# Altium project buck_boost.PrjPcb
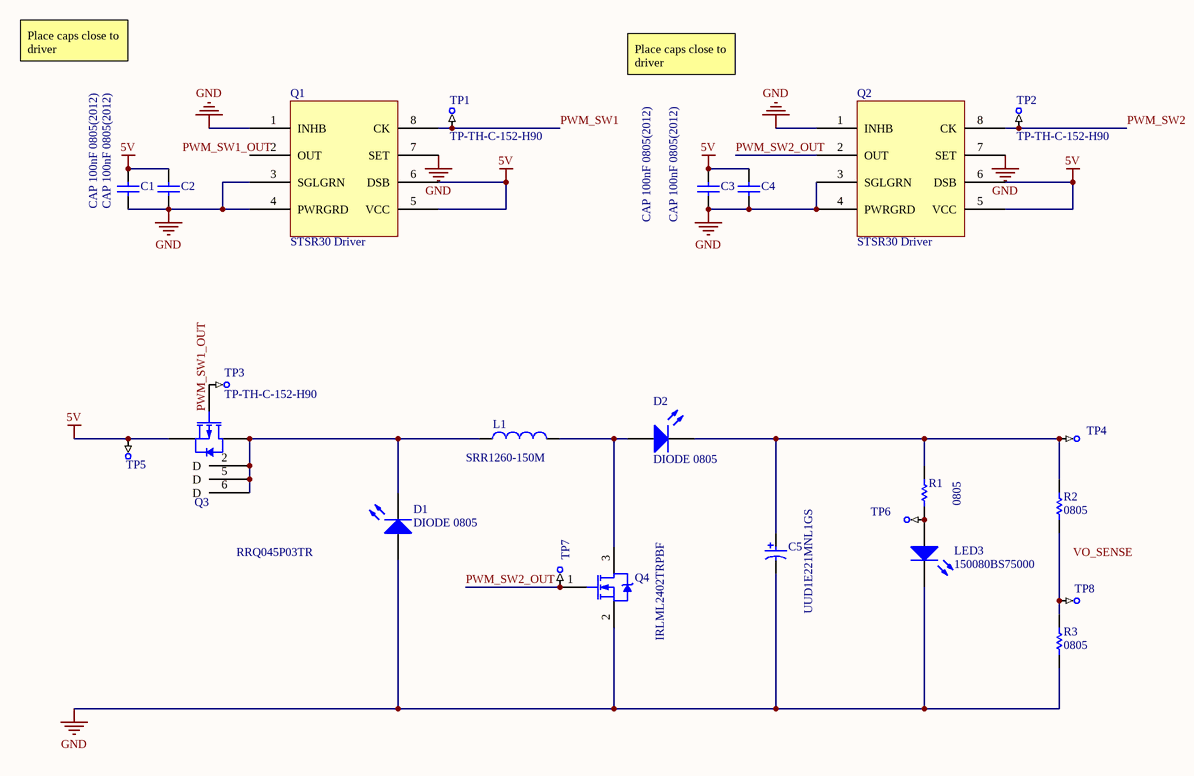
[diagram p0: buck_boost_schematic.SchDoc]
2 sheets, 49 parts. Net scope: global (net labels, ports and power ports of the same name join across sheets).
Board file: buck_boost.PcbDoc
Sheets:
  buck_boost_schematic.SchDoc
  control_and_power.SchDoc

## Sheet buck_boost_schematic.SchDoc
size A4

### Parts
C1  CAP 100nF 0805(2012)  [CAPC0805(2012)100_L]
C2  CAP 100nF 0805(2012)  [CAPC0805(2012)100_L]
C3  CAP 100nF 0805(2012)  [CAPC0805(2012)100_L]
C4  CAP 100nF 0805(2012)  [CAPC0805(2012)100_L]
C5  UUD1E221MNL1GS  [NIC-CAPA2-8X10_V]
D1  DIODE 0805  [0805_A]
D2  DIODE 0805  [0805_A]
L1  SRR1260-150M  [BOUR-SRR1260_V]
LED3  150080BS75000  [0805_A]
Q1  STSR30 Driver  [NXP-SOT96-1_L]
Q2  STSR30 Driver  [NXP-SOT96-1_L]
Q3  RRQ045P03TR  [DDC0006A_L]
Q4  IRLML2402TRPBF  [INTR-IRLML2402TRPBF-3_V]
R1  0805  [RESC0805(2012)_N]
R2  0805  [RESC0805(2012)_N]
R3  0805  [RESC0805(2012)_N]
TP1  TP-TH-C-152-H90  [TP-TH-C-152-H90]  (no BOM)
TP2  TP-TH-C-152-H90  [TP-TH-C-152-H90]  (no BOM)
TP3  TP-TH-C-152-H90  [TP-TH-C-152-H90]  (no BOM)
TP4  (no value)  [TP-TH-C-152-H90]  (no BOM)
TP5  (no value)  [TP-TH-C-152-H90]  (no BOM)
TP6  (no value)  [TP-TH-C-152-H90]  (no BOM)
TP7  (no value)  [TP-TH-C-152-H90]  (no BOM)
TP8  (no value)  [TP-TH-C-152-H90]  (no BOM)

### Nets
5V: C1.2 C2.2 C3.2 C4.2 Q1.5(VCC) Q1.6(DSB) Q2.5(VCC) Q2.6(DSB) Q3.4(S) TP5.1
GND: C1.1 C2.1 C3.1 C4.1 C5.2 D1.2(A) LED3.1(K) Q1.1(INHB) Q1.3(SGLGRN) Q1.4(PWRGRD) Q1.7(SET) Q2.1(INHB) Q2.3(SGLGRN) Q2.4(PWRGRD) Q2.7(SET) Q4.2(S) R3.1
PWM_SW1: Q1.8(CK) TP1.1
PWM_SW2: Q2.8(CK) TP2.1
PWM_SW2_OUT: Q2.2(OUT) Q4.1(G) TP7.1
NetC5_1: C5.1 D2.1(K) R1.2 R2.2 TP4.1
NetD1_1: D1.1(K) L1.1 Q3.1(D) Q3.2(D) Q3.5(D) Q3.6(D)
NetD2_2: D2.2(A) L1.2 Q4.3(D)
NetLED3_2: LED3.2(A) R1.1 TP6.1
NetQ3_3: Q3.3(G) TP3.1
NetR2_1: R2.1 R3.2 TP8.1

Not connected (* = marked no-connect by the designer): Q1 2(OUT)

### Notes on the sheet
- Place caps close to driver
- Labels drawn without touching a wire or pin: PWM_SW1_OUT, VO_SENSE

### Library data of the parts
C1-C4 = CMP-1036-04519-1: CAP 220nF 6.3V ±10% 0805 (2012 Metric) Thickness 1mm SMD; Case-EIA: 0805; Tolerance: Â±10%; Case-Metric: 2012; Max Thickness: 1 mm; Value: 220nF; Rated Voltage: 6.3 V; Technology: SMT
C5 = CMP-0687-00079-1: Aluminum Electrolytic Capacitor, UD Series, Low Impedance, 220 uF, 25 V, + / - 20%, -55 to 105 degC, Chip Type, 8 x 10 mm D x L, Pb-Free, Reel; Manufacturer: Nichicon; Impedance: 0.17 Ohm; Tolerance Rated Capacitance: -20 to 20%; Packing: Dia382mm Reel; Endurance Time: 5000 h; Rated Voltage: 25 V; Rated Ripple Current (at 100kHz): 450 mA; Rated Capacitance: 220 uF; PartNumber: UUD1E221MNL1GS; DatasheetVersion: 08/2012; ComponentLink1Description: Manufacturer URL; Length: 10 mm; ComponentLink3Description: Package Specification; RoHS: TRUE; ComponentLink2Description: Datasheet; Diameter: 8 mm; ComponentLink2URL: http://products.nichicon.co.jp/en/pdf/XJA043/e-ud.pdf; ComponentLink3URL: http://products.nichicon.co.jp/en/pdf/XJA043/e-ud.pdf; PackageReference: CAPAE-D8H10; ComponentLink1URL: http://www.nichicon.co.jp/; PackageDescription: 2-Pin Surface Mount Device, Diameter 8 mm, Height 10 mm, Pitch 6.5 mm; Mounting Technology: Surface Mount
D1 D2 = CMP-1426-00008-1: SMD mono-color Chip LED, WL-SMCW, Blue; Manufacturer: Wuerth Elektronik; PartNumber: 150080BS75000; Color: Blue; ComponentLink2URL: http://katalog.we-online.com/led/datasheet/150080BS75000.pdf; ComponentLink1URL: http://www.we-online.com; ComponentLink2Description: Datasheet; PackageReference: 0805_A; ComponentLink1Description: Manufacturer URL
L1 = CMP-2000-07146-1: Shielded Power Inductor, 15 uH, +/- 20%, -40 to 125 degC, 2-Pin SMD, RoHS, Tape and Reel; Manufacturer: Bourns; Core Material: Ferrite; Inductance: 15uH; Product Height: 6.5mm; Maximum DC Current: 5A; Maximum DC Resistance: 27mOhm; Minimum Quality Factor: 25(Typ)@2.52MHz; Package Reference: SRR1260; Package Description: 2-Pin Surface Mount Device, Body 12.5 x 12.5 mm; Datasheet URL: http://www.bourns.com/docs/Product-Datasheets/SRR1260.pdf; Mounting Technology: SurfaceMount; Category: InductorSurfaceMount; Package/Case: 12.8X12.8X6.5; Manufacturer URL: http://www.bourns.com/; Datasheet Version: 03/2015; Tolerance: 20%; Type: Power
LED3 = CMP-1426-00008-1: SMD mono-color Chip LED, WL-SMCW, Blue; Manufacturer: Wuerth Elektronik; Color: Blue; ComponentLink2URL: http://katalog.we-online.com/led/datasheet/150080BS75000.pdf; ComponentLink1URL: http://www.we-online.com; ComponentLink2Description: Datasheet; PackageReference: 0805_A; ComponentLink1Description: Manufacturer URL; PartNumber: 150080BS75000
Q1 Q2 = STSR30
Q3 = MOSFET_P - RRQ045P03TR
Q4 = CMP-2000-05155-1: HEXFET(R) Power MOSFET, N-Channel, 20 V, 1.2 A, 3-Pin SOT-23, RoHS, Tape and Reel; Manufacturer: International Rectifier; Voltage Vgs Rds on Measurement: 4.5V; Current Id Max: 1.2A; External Width: 3.05mm; Transistor Polarity: NChannel; No. of Pins: 3; Power Dissipation Pd: 540mW; External Length / Height: 1.12mm; Full Power Rating Temperature: 25degC; On Resistance Rds(on): 250mohm; Voltage Vds Typ: 20V; SMD Marking: 1A; No. of Transistors: 1; Reel Quantity: 3000; External Depth: 2.5mm; Pulse Current Idm: 7.4A; Junction Temperature Tj Min: -55degC; Threshold Voltage Vgs Typ: 700mV; SVHC: NoSVHC(19-Dec-2012); Datasheet URL: https://datasheet.ciiva.com/29326/162826-da-01-en-irlml-2402tr-29326791.pdf; Tape Width: 8mm; Operating Temperature Range: -55degCto+150degC; Manufacturer URL: http://internationalrectifier.com/; Termination Type: SMD; Datasheet Version: Jan-03; Current Temperature: 25degC; Package / Case: SOT-23; Drain Source Voltage Vds: 20V; Rds(on) Test Voltage Vgs: 4.5V; Continuous Drain Current Id: 1.2A; Transistor Case Style: SOT-23; Voltage Vgs th Min: 700mV; Voltage Vgs Max: 700mV
R1-R3 = CMP-1013-00064-1: 390R 0.125W 5% 0805 (2012 Metric)  SMD; Value: 390.00 Ohm; Case-Metric: 2012; Case-EIA: 0805; Power: 0.125 W; Tolerance: 5 %; Technology: SMT
TP1-TP8 = CMP-0484-00003-2: Test Point, Through Hole, Hole Size 0.9 mm, PCB Mount with Silkscreen Box; Manufacturer: No Vendor; PartNumber: TP-TH-C-152-H90

## Sheet control_and_power.SchDoc
size A4
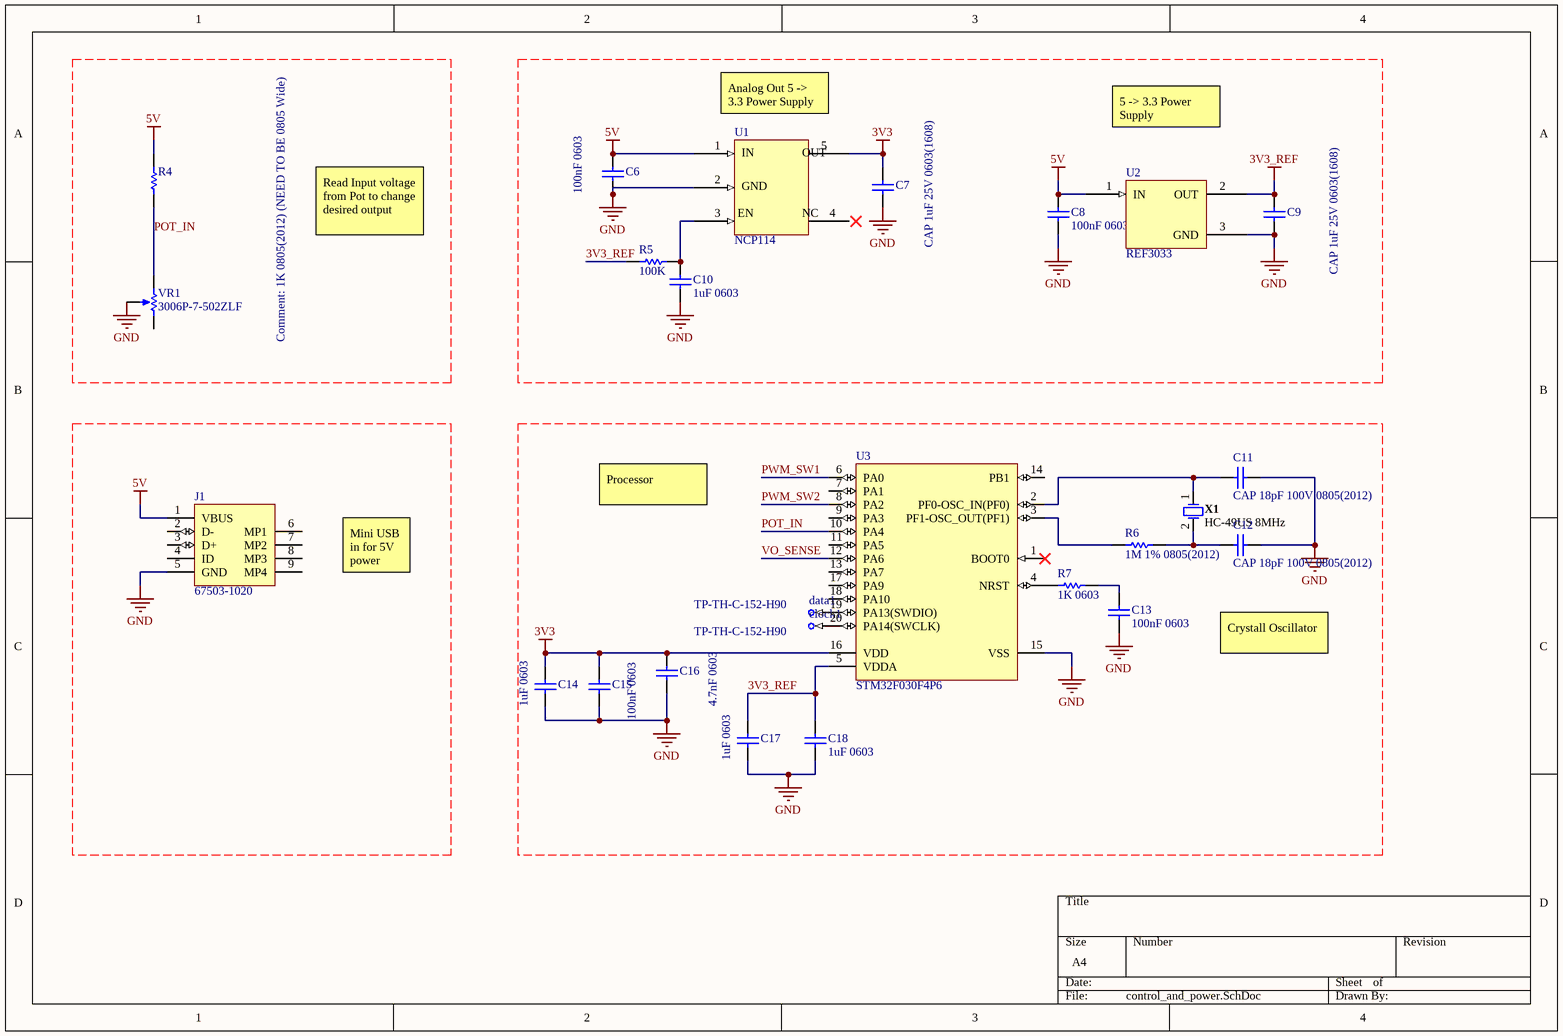
[diagram p1: control_and_power.SchDoc]

### Parts
C6  100nF 0603  [CAPC0603(1608)100_M]
C7  CAP 1uF 25V 0603(1608)  [CAPC0603(1608)100_M]
C8  100nF 0603  [CAPC0603(1608)100_M]
C9  CAP 1uF 25V 0603(1608)  [CAPC0603(1608)100_M]
C10  1uF 0603  [CAPC0603(1608)100_M]
C11  CAP 18pF 100V 0805(2012)  [CAPC0805(2012)145_M]
C12  CAP 18pF 100V 0805(2012)  [CAPC0805(2012)145_M]
C13  100nF 0603  [CAPC0603(1608)100_M]
C14  1uF 0603  [CAPC0603(1608)100_M]
C15  100nF 0603  [CAPC0603(1608)100_M]
C16  4.7nF 0603  [CAPC0603(1608)100_M]
C17  1uF 0603  [CAPC0603(1608)100_M]
C18  1uF 0603  [CAPC0603(1608)100_M]
clock1  TP-TH-C-152-H90  [TP-TH-C-152-H90]  (no BOM)
data1  TP-TH-C-152-H90  [TP-TH-C-152-H90]  (no BOM)
J1  67503-1020  [MOLX-67503-1020_V]
R4  1K 0805(2012) (NEED TO BE 0805 Wide)  [RESC0805(2012)_N]
R5  100K  [RESC0603(1608)_N]
R6  1M 1% 0805(2012)  [RESC0805(2012)_N]
R7  1K 0603  [RESC0603(1608)_N]
U1  NCP114  [SOT23-5_N]
U2  REF3033  [SOT23-3]
U3  STM32F030F4P6  [STM-TSSOP20_L]
VR1  3006P-7-502ZLF  [BOUR-3006P-3_V]
X1  HC-49US 8MHz  [JPY-HC-49US]

### Nets
3V3: C7.2 C14.2 C15.2 C16.2 U1.5(OUT) U3.16(VDD)
3V3_REF: C9.2 C17.2 C18.2 R5.1 U2.2(OUT) U3.5(VDDA)
5V: C6.2 C8.2 J1.1(VBUS) R4.2 U1.1(IN) U2.1(IN)
GND: C6.1 C7.1 C8.1 C9.1 C10.1 C11.2 C12.2 C13.1 C14.1 C15.1 C16.1 C17.1 C18.1 J1.5(GND) U1.2(GND) U2.3(GND) U3.15(VSS) VR1.2(WIPER)
POT_IN: R4.1 U3.10(PA4) VR1.3(CW)
PWM_SW1: U3.6(PA0)
PWM_SW2: U3.8(PA2)
VO_SENSE: U3.12(PA6)
NetC10_2: C10.2 R5.2 U1.3(EN)
NetC11_1: C11.1 U3.2(PF0-OSC_IN(PF0)) X1.1
NetC12_1: C12.1 R6.2 X1.2
NetC13_2: C13.2 R7.2
Netclock1_1: clock1.1 U3.20(PA14(SWCLK))
Netdata1_1: data1.1 U3.19(PA13(SWDIO))
NetR6_1: R6.1 U3.3(PF1-OSC_OUT(PF1))
NetR7_1: R7.1 U3.4(NRST)

Not connected (* = marked no-connect by the designer): J1 2(D-) 3(D+) 4(ID) 6(MP1) 7(MP2) 8(MP3) 9(MP4); U1 4(NC); U3 1(BOOT0)* 7(PA1) 9(PA3) 11(PA5) 13(PA7) 14(PB1) 17(PA9) 18(PA10); VR1 1(CCW)

### Notes on the sheet
- (near U1) Analog Out 5 -> 3.3 Power Supply
- 5 -> 3.3 Power Supply
- Read Input voltage from Pot to change desired output
- Processor
- Mini USB in for 5V power
- Crystall Oscillator

### Library data of the parts
C6-C10 C13-C18 = CMP-1035-02742-1: CAP 1uF 25V -20% to +80% 0603 (1608 Metric) Thickness 1mm SMD; Case-Metric: 1608; Case-EIA: 0603; Technology: SMT; Tolerance: -20% to +80%; Max Thickness: 1 mm; Value: 1uF; Rated Voltage: 25 V
C11 C12 = CMP-1036-01160-1: CAP 18pF 100V ±10% 0805 (2012 Metric) Thickness 1.45mm SMD; Case-Metric: 2012; Tolerance: Â±10%; Case-EIA: 0805; Value: 18pF; Max Thickness: 1.45 mm; Technology: SMT; Rated Voltage: 100 V
clock1 data1 = CMP-0484-00003-2: as TP1 on sheet buck_boost_schematic; PartNumber: TP-TH-C-152-H90
J1 = CMP-0411-00002-1: USB, MINI, SMD, RA KME04-USBMU03A01; Manufacturer: Molex; ComponentLink1URL: http://www.molex.com/; PartNumber: 67503-1020; Mounting Technology: Surface Mount; ComponentLink1Description: Manufacturer URL; Terminal Pitch: 0.8 mm; DatasheetVersion: Rev F, 06/2009; ComponentLink2Description: Datasheet; PackageDescription: Mini USB Connector, SMT, Righer Angle; ComponentLink2URL: http://www.molex.com/pdm_docs/sd/675031020_sd.pdf; PackageReference: 67503-1020
R4 = CMP-1013-00037-1: 30R 0.125W 5% 0805 (2012 Metric)  SMD; Case-Metric: 2012; Value: 30.00 Ohm; Case-EIA: 0805; Power: 0.125 W; Technology: SMT; Tolerance: 5 %
R5 R7 = CMP-1012-00542-1: 2K 0.1W 1% 0603 (1608 Metric)  SMD; Case-EIA: 0603; Case-Metric: 1608; Power: 0.1 W; Technology: SMT; Tolerance: 1 %
  R5: Value: 100K
  R7: Value: 1K
R6 = CMP-1013-00849-1: 1M 0.125W 1% 0805 (2012 Metric)  SMD; Value: 1000000.00 Ohm; Case-Metric: 2012; Case-EIA: 0805; Technology: SMT; Power: 0.125 W; Tolerance: 1 %
U3 = CMP-0304-00039-2: ARM Cortex-M0 32-bit MCU, 16 KB Flash, 4 KB Internal RAM, 15 I/Os, 20-pin TSSOP, -40 to 85 degC, Tube; I/Os (High Current): 15; FLASH Size (Prog) (kB): 16; Internal RAM Size (kB): 4; Supply Voltage(Vcc) min (V): 2.4; Operating Frequency(F) (Processor speed) (MHz): 48; ComponentLink2URL: http://www.st.com/st-web-ui/static/active/en/resource/technical/document/datasheet/DM00088500.pdf; Core: ARM Cortex-M0; ComponentLink2Description: Datasheet; PackageDescription: 20-Pin Thin Shrink Small Outline Package, 6.5 x 4.4 mm Body, 0.65 mm Pitch; Mounting Technology: Surface Mount; ComponentLink1URL: http://www.st.com/web/en/home.html; PackageVersion: Rev. 1, 11/2012; ComponentLink3Description: Package Specification; PartNumber: STM32F030F4P6; ComponentLink3URL: http://www.st.com/st-web-ui/static/active/en/resource/technical/document/datasheet/DM00065136.pdf; DatasheetVersion: Rev. 1; PackageReference: TSSOP20; ComponentLink1Description: Manufacturer URL; Packing: Tube
VR1 = CMP-0972-00009-1: Trimming Potentiometer, 5K Ohm +/- 10%, -55 to 125 degC, 3-Pin 19.05 x 4.83 x 6.6 mm THD, Transparent Housing, RoHS; Manufacturer: Bourns; Resistance (kOhm): 5; Resistance Tolerance: +/- 10%; Rotational Life: 200 Cycles; Number of Turns: 15; PackageDescription: 3-Pin THD, Body 19.05 x 4.83 mm, Height 6.6 mm; ComponentLink3Description: Package Specification; ComponentLink1URL: http://www.bourns.com/; PackageReference: 3006P-3; RoHS: TRUE; PackageVersion: Apr-14; PartNumber: 3006P-7-502ZLF; Mounting Technology: Through Hole; ComponentLink3URL: http://www.bourns.com/data/global/pdfs/3006.pdf; ComponentLink1Description: Manufacturer URL; Temperature Range: -55 to 125 degC; DatasheetVersion: Apr-14; ComponentLink2Description: Datasheet; ComponentLink2URL: http://www.bourns.com/data/global/pdfs/3006.pdf
X1 = CMP-2100-03645-1: Crystal, 16 MHz, +/- 30 ppm, 18 pF, -20 to 70 degC, 2-Pin THD; Manufacturer: Jing peng yuan; Datasheet URL: https://statics3.seeedstudio.com/images/opl/datasheet/306010014.pdf; Package Description: 2-Pin Throug Hole Device, Body 11.05 x 4.65 mm, Pitch 4.9 mm; Datasheet Version: 42125.0; Package Reference: HC-49US

## Nets that join several sheets
5V: buck_boost_schematic (10 pins), control_and_power (6 pins)
GND: buck_boost_schematic (17 pins), control_and_power (18 pins)
PWM_SW1: buck_boost_schematic (Q1.8 TP1.1), control_and_power (U3.6)
PWM_SW2: buck_boost_schematic (Q2.8 TP2.1), control_and_power (U3.8)